# EasyEDA schematic SCH-Unified_EasyEDA.json

## Sheets
1 Unified_Sheet_1: TITLE: Sheet_1; REV: 1.0; Date: 2024-01-01; Sheet: 1/2; Drawn By: scottguiness; Company: Scott and Marco
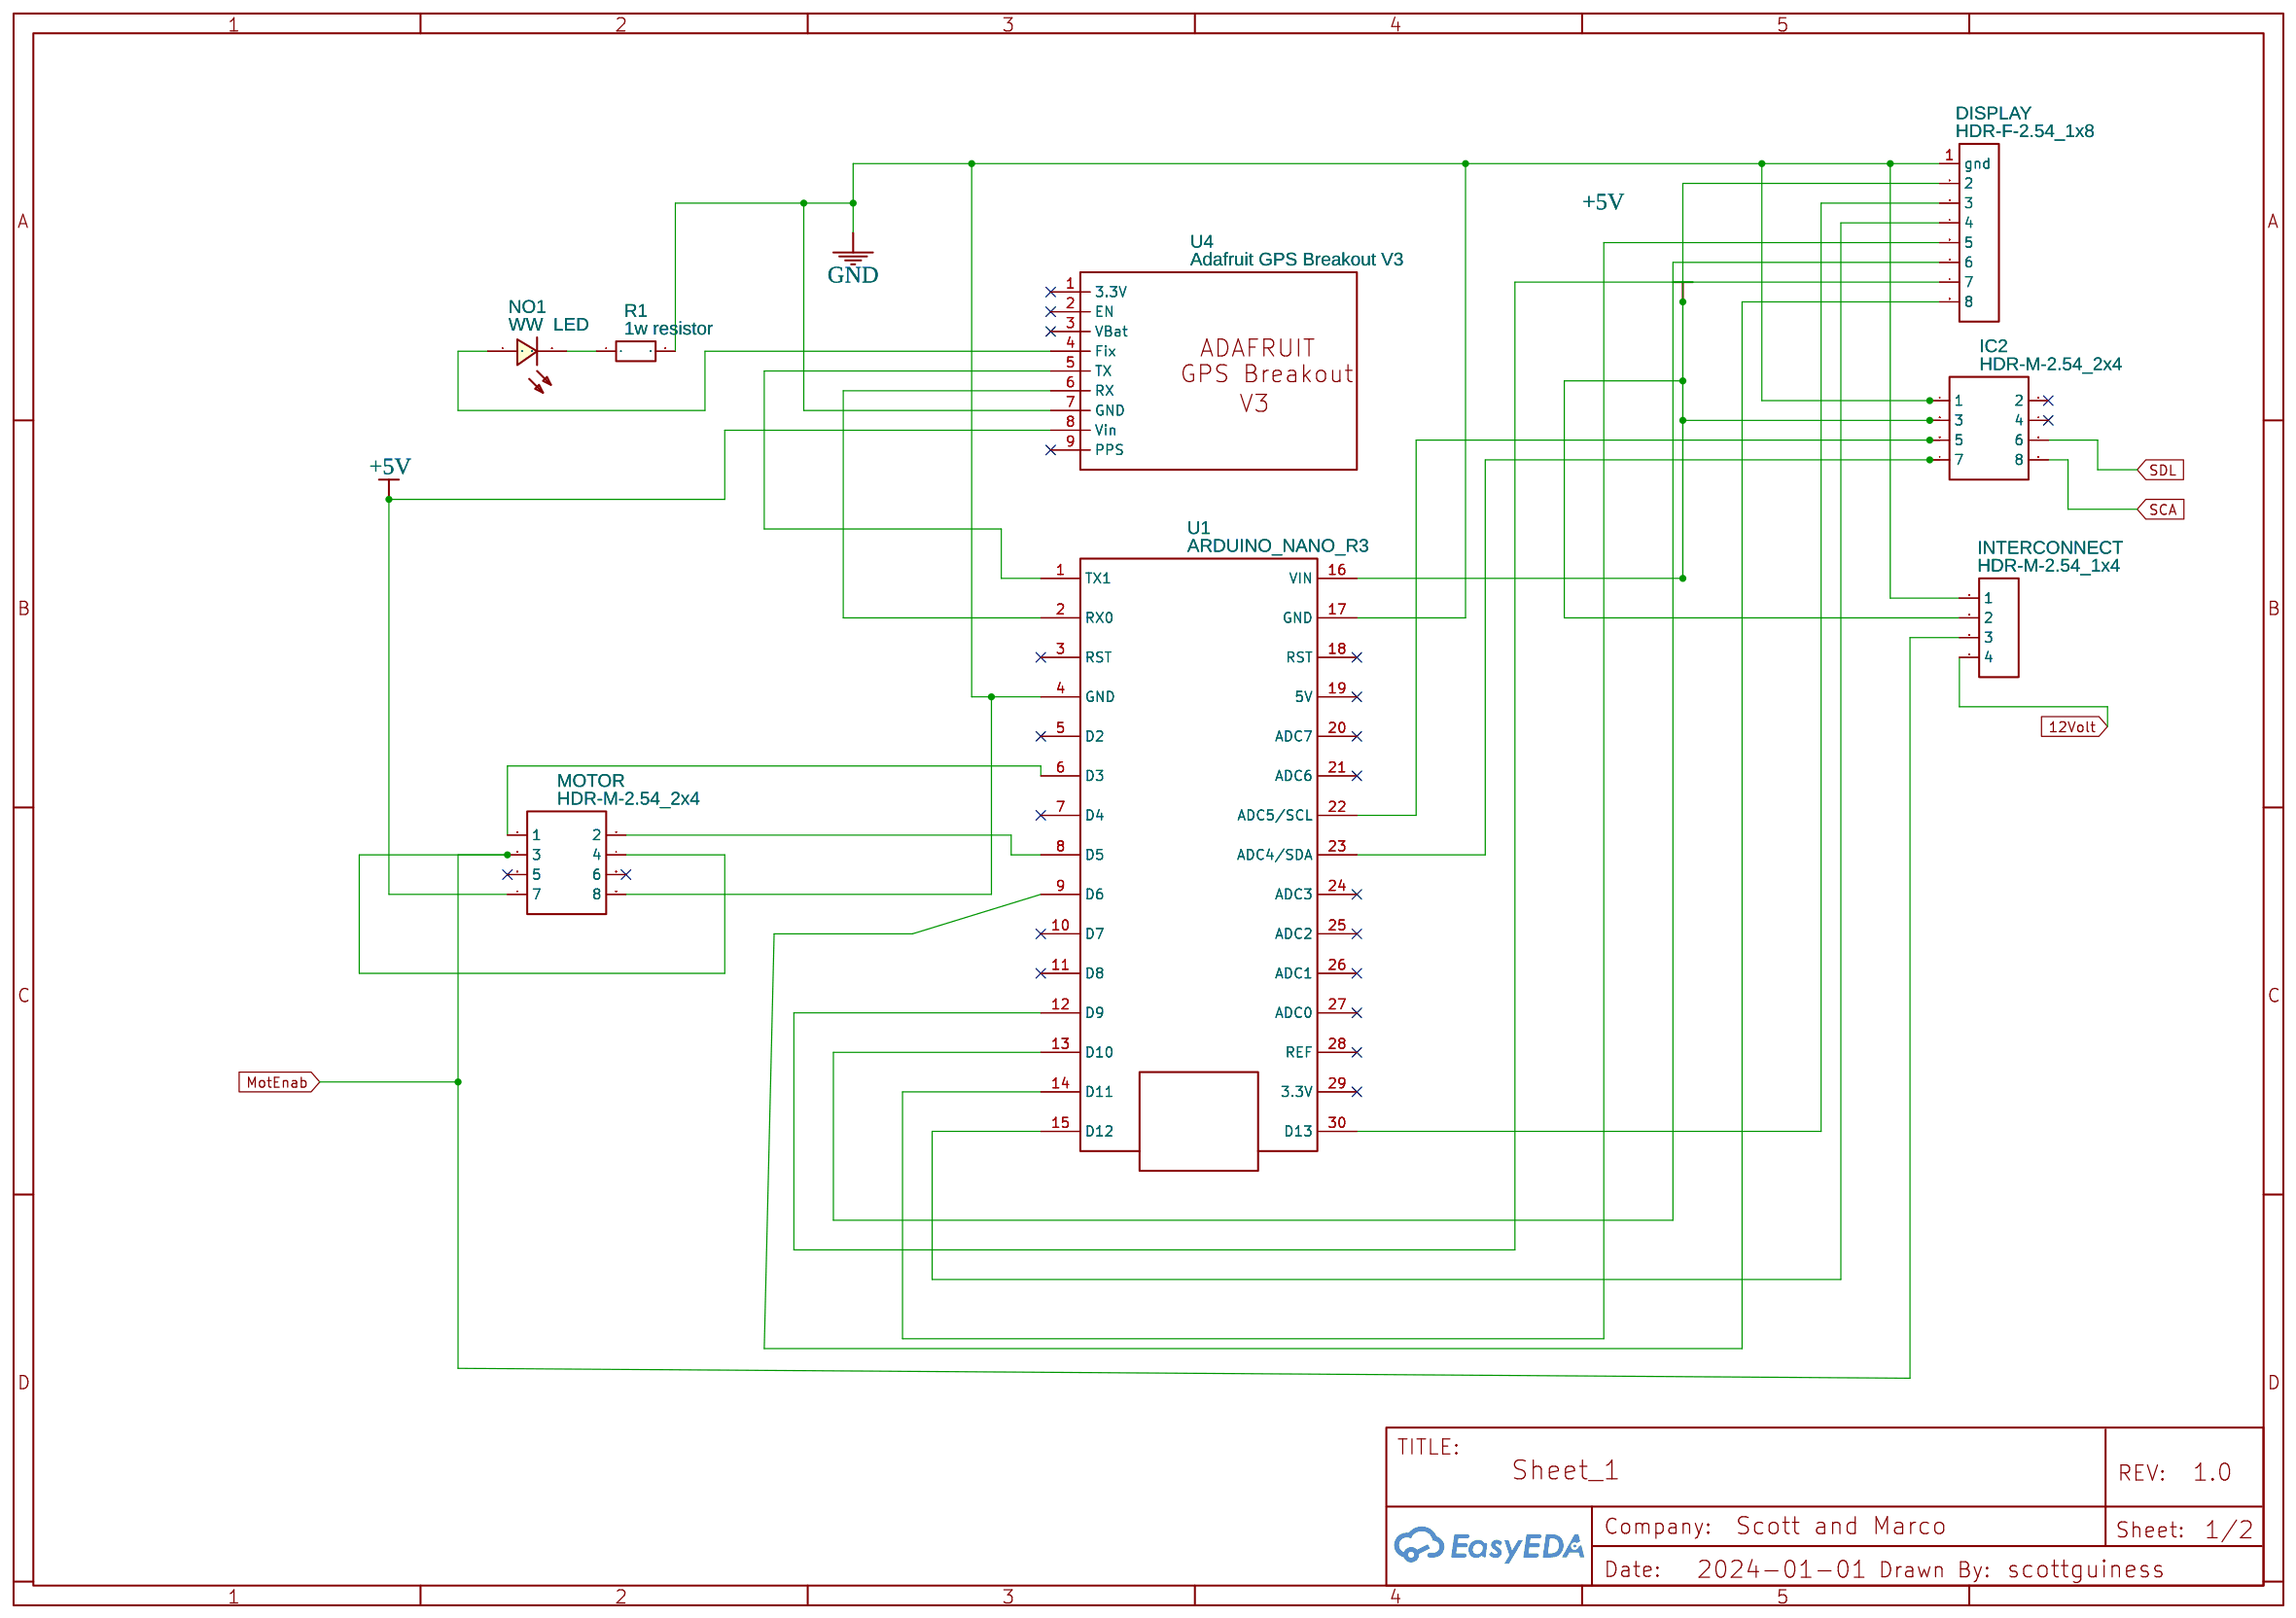
[diagram p0: Unified_Sheet_1]
2 Unified_Sheet_2: TITLE: Sheet_2; Date: 2024-01-03; Sheet: 2/2
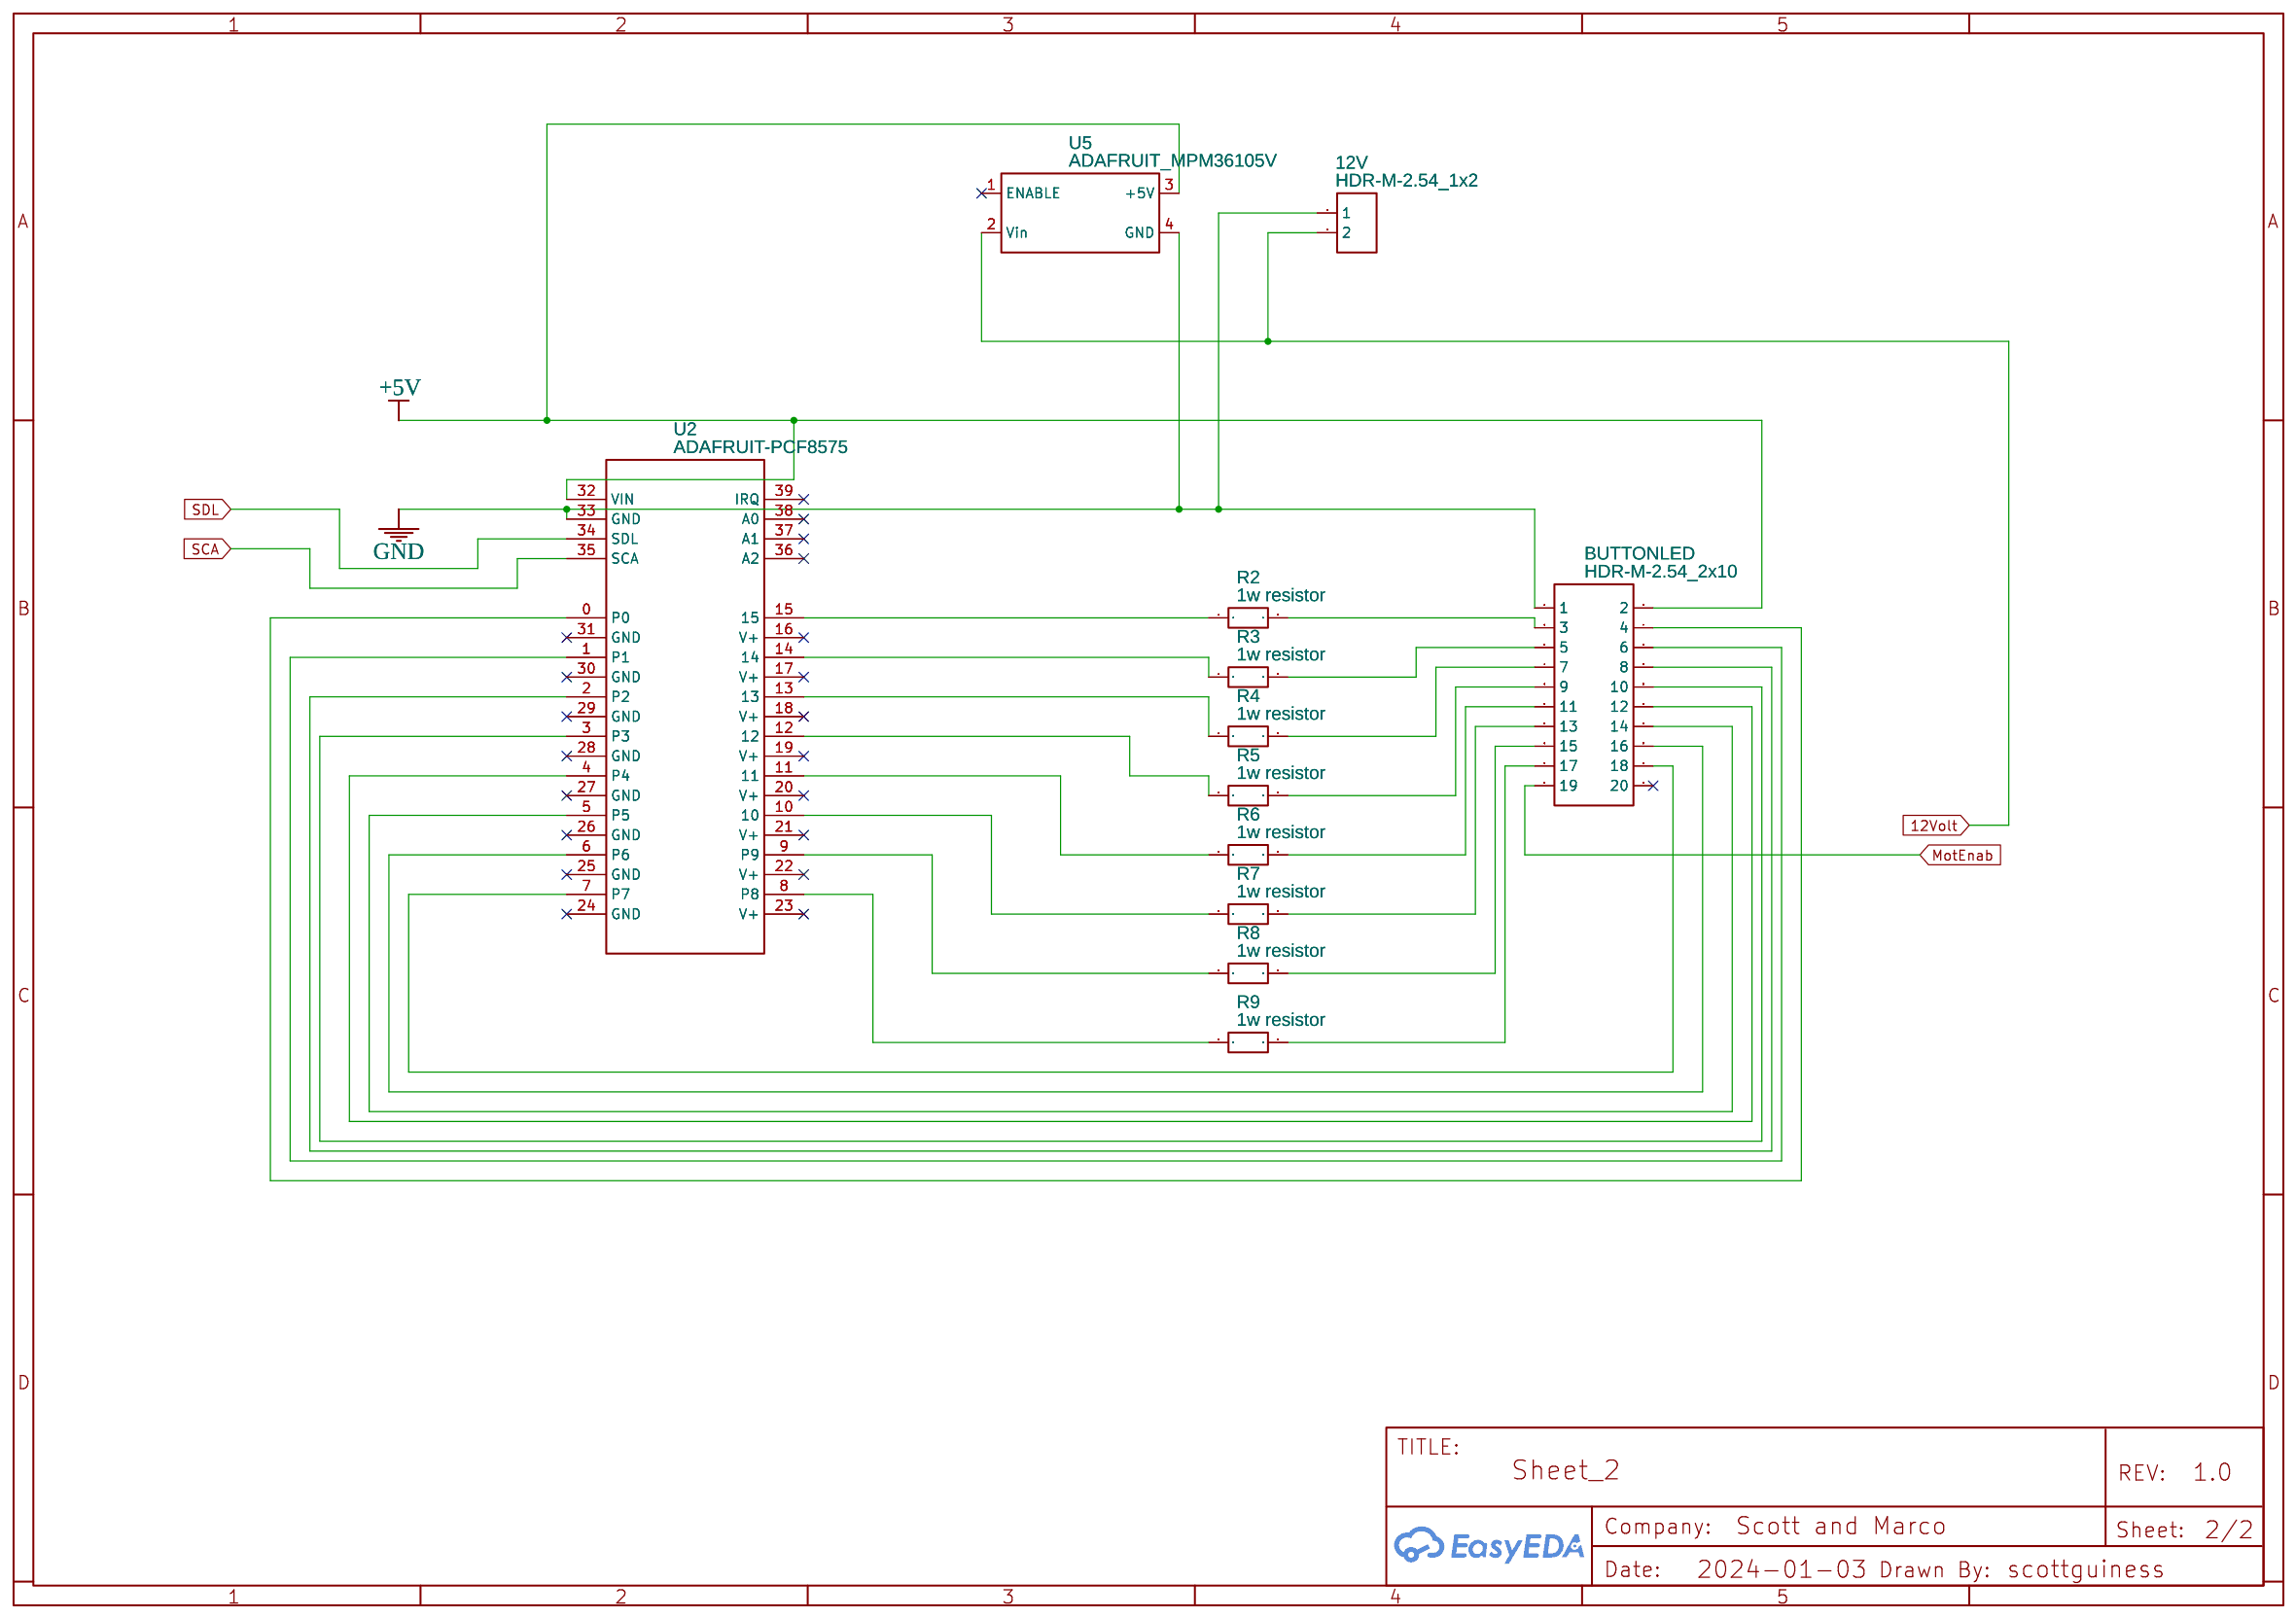
[diagram p1: Unified_Sheet_2]

## Parts
sheet Unified_Sheet_1
DISPLAY  HDR-F-2.54_1x8  [HDR-F-2.54_1X8]
IC2  HDR-M-2.54_2x4  [HDR-M-2.54_2X4]
INTERCONNECT  HDR-M-2.54_1x4  [HDR-M-2.54_1X4]
MOTOR  HDR-M-2.54_2x4  [HDR-M-2.54_2X4]
NO1  WW  LED  [LED-TH_LED-3MM_RED]
R1  1w resistor  [2W RESITOR]
U1  ARDUINO_NANO_R3  [ADUINO NANO R3]
U4  Adafruit GPS Breakout V3  [ADAFRUIT GPS BREAKOUT]
sheet Unified_Sheet_2
12V  HDR-M-2.54_1x2  [HDR-M-2.54_1X2]
BUTTONLED  HDR-M-2.54_2x10  [HDR-M-2.54_2X10]
R2  1w resistor  [2W RESITOR]
R3  1w resistor  [2W RESITOR]
R4  1w resistor  [2W RESITOR]
R5  1w resistor  [2W RESITOR]
R6  1w resistor  [2W RESITOR]
R7  1w resistor  [2W RESITOR]
R8  1w resistor  [2W RESITOR]
R9  1w resistor  [2W RESITOR]
U2  ADAFRUIT-PCF8575  [ADAFRUIT-PCF8575]
U5  ADAFRUIT_MPM36105V  [ADAFRUIT_MPM3610_MODULE5]

## Library data of the parts
DISPLAY = HDR-F-2.54_1x8: Supplier Part: C225505; Supplier: LCSC; Contributor: LCEDA_Lib
IC2 MOTOR = HDR-M-2.54_2x4: Supplier Part: C58363; Supplier: LCSC; Contributor: LCEDA_Lib
INTERCONNECT = HDR-M-2.54_1x4: Supplier Part: C124378; Supplier: LCSC; Contributor: LCEDA_Lib
NO1 = LED-3MM红: Supplier: LCSC; Supplier Part: C9900003389; Manufacturer Part: LED-3mm红; link: https://img.jlc.com/pdf/applyPasteComponent/2021-12-06/748033A/127ffe71aa84443fa05d6ffed81d0b6e/LED-3mm.pdf; Contributor: csnagyt; JLCPCB Part Class: Extended Part
R1-R9 = 1w resistor: Contributor: Kagutsuchi
U1 = ARDUINO_NANO_R3: Contributor: Nikolay Yanev
U4 = Adafruit GPS Breakout V3: Manufacturer Part: New SchematicLib; Contributor: NiklasC; Supplier Part: 746; Supplier: Adafruit; link: https://www.adafruit.com/product/746
12V = HDR-M-2.54_1x2: Supplier Part: C124375; Supplier: LCSC; Contributor: LCEDA_Lib
BUTTONLED = HDR-M-2.54_2x10: Supplier Part: C124359; Supplier: LCSC; Contributor: LCEDA_Lib
U2 = ADAFRUIT-PCF8575: Contributor: williambaucom
U5 = ADAFRUIT_MPM36105V: Supplier: Digi-Key; JLCPCB Part Class: Extended Part; Contributor: Aidan Farley

## Nets
12Volt: 12V.2 INTERCONNECT.4 U5.2(Vin)
+5V: BUTTONLED.2 DISPLAY.2 IC2.3 INTERCONNECT.2 MOTOR.7 U1.16(VIN) U2.32(VIN) U4.8(Vin) U5.3(+5V)
GND: 12V.1 BUTTONLED.1 DISPLAY.1(gnd) IC2.1 INTERCONNECT.1 MOTOR.8 R1.2(1) U1.4(GND) U1.17(GND) U2.33(GND) U4.7(GND) U5.4(GND)
MotEnab: BUTTONLED.19 INTERCONNECT.3 MOTOR.3 MOTOR.4
SCA: IC2.8 U2.35(SCA)
SDL: IC2.6 U2.34(SDL)
Net-(BUTTONLED-3): BUTTONLED.3 R2.2(1)
Net-(BUTTONLED-4): BUTTONLED.4 U2.0(P0)
Net-(BUTTONLED-5): BUTTONLED.5 R3.2(1)
Net-(BUTTONLED-6): BUTTONLED.6 U2.1(P1)
Net-(BUTTONLED-7): BUTTONLED.7 R4.2(1)
Net-(BUTTONLED-8): BUTTONLED.8 U2.2(P2)
Net-(BUTTONLED-9): BUTTONLED.9 R5.2(1)
Net-(BUTTONLED-10): BUTTONLED.10 U2.3(P3)
Net-(BUTTONLED-11): BUTTONLED.11 R6.2(1)
Net-(BUTTONLED-12): BUTTONLED.12 U2.4(P4)
Net-(BUTTONLED-13): BUTTONLED.13 R7.2(1)
Net-(BUTTONLED-14): BUTTONLED.14 U2.5(P5)
Net-(BUTTONLED-15): BUTTONLED.15 R8.2(1)
Net-(BUTTONLED-16): BUTTONLED.16 U2.6(P6)
Net-(BUTTONLED-17): BUTTONLED.17 R9.2(1)
Net-(BUTTONLED-18): BUTTONLED.18 U2.7(P7)
Net-(DISPLAY-3): DISPLAY.3 U1.30(D13)
Net-(DISPLAY-4): DISPLAY.4 U1.15(D12)
Net-(DISPLAY-5): DISPLAY.5 U1.14(D11)
Net-(DISPLAY-6): DISPLAY.6 U1.13(D10)
Net-(DISPLAY-7): DISPLAY.7 U1.12(D9)
Net-(DISPLAY-8): DISPLAY.8 U1.9(D6)
Net-(IC2-5): IC2.5 U1.22(ADC5/SCL)
Net-(IC2-7): IC2.7 U1.23(ADC4/SDA)
Net-(MOTOR-1): MOTOR.1 U1.6(D3)
Net-(MOTOR-2): MOTOR.2 U1.8(D5)
Net-(NO1-1): NO1.1 U4.4(Fix)
Net-(NO1-2): NO1.2 R1.1(2)
Net-(R2-1): R2.1(2) U2.15
Net-(R3-1): R3.1(2) U2.14
Net-(R4-1): R4.1(2) U2.13
Net-(R5-1): R5.1(2) U2.12
Net-(R6-1): R6.1(2) U2.11
Net-(R7-1): R7.1(2) U2.10
Net-(R8-1): R8.1(2) U2.9(P9)
Net-(R9-1): R9.1(2) U2.8(P8)
Net-(U1-1): U1.1(TX1) U4.5(TX)
Net-(U1-2): U1.2(RX0) U4.6(RX)

Not connected (* = marked no-connect by the designer): BUTTONLED 20*; IC2 2* 4*; MOTOR 5* 6*; U1 3(RST)* 5(D2)* 7(D4)* 10(D7)* 11(D8)* 18(RST)* 19(5V)* 20(ADC7)* 21(ADC6)* 24(ADC3)* 25(ADC2)* 26(ADC1)* 27(ADC0)* 28(REF)* 29(3.3V)*; U2 16(V+)* 17(V+)* 18(V+)* 19(V+)* 20(V+)* 21(V+)* 22(V+)* 23(V+)* 24(GND)* 25(GND)* 26(GND)* 27(GND)* 28(GND)* 29(GND)* 30(GND)* 31(GND)* 36(A2)* 37(A1)* 38(A0)* 39(IRQ)*; U4 1(3.3V)* 2(EN)* 3(VBat)* 9(PPS)*; U5 1(ENABLE)*
